# Altium schematic sheet microcontroller.SchDoc
size A2
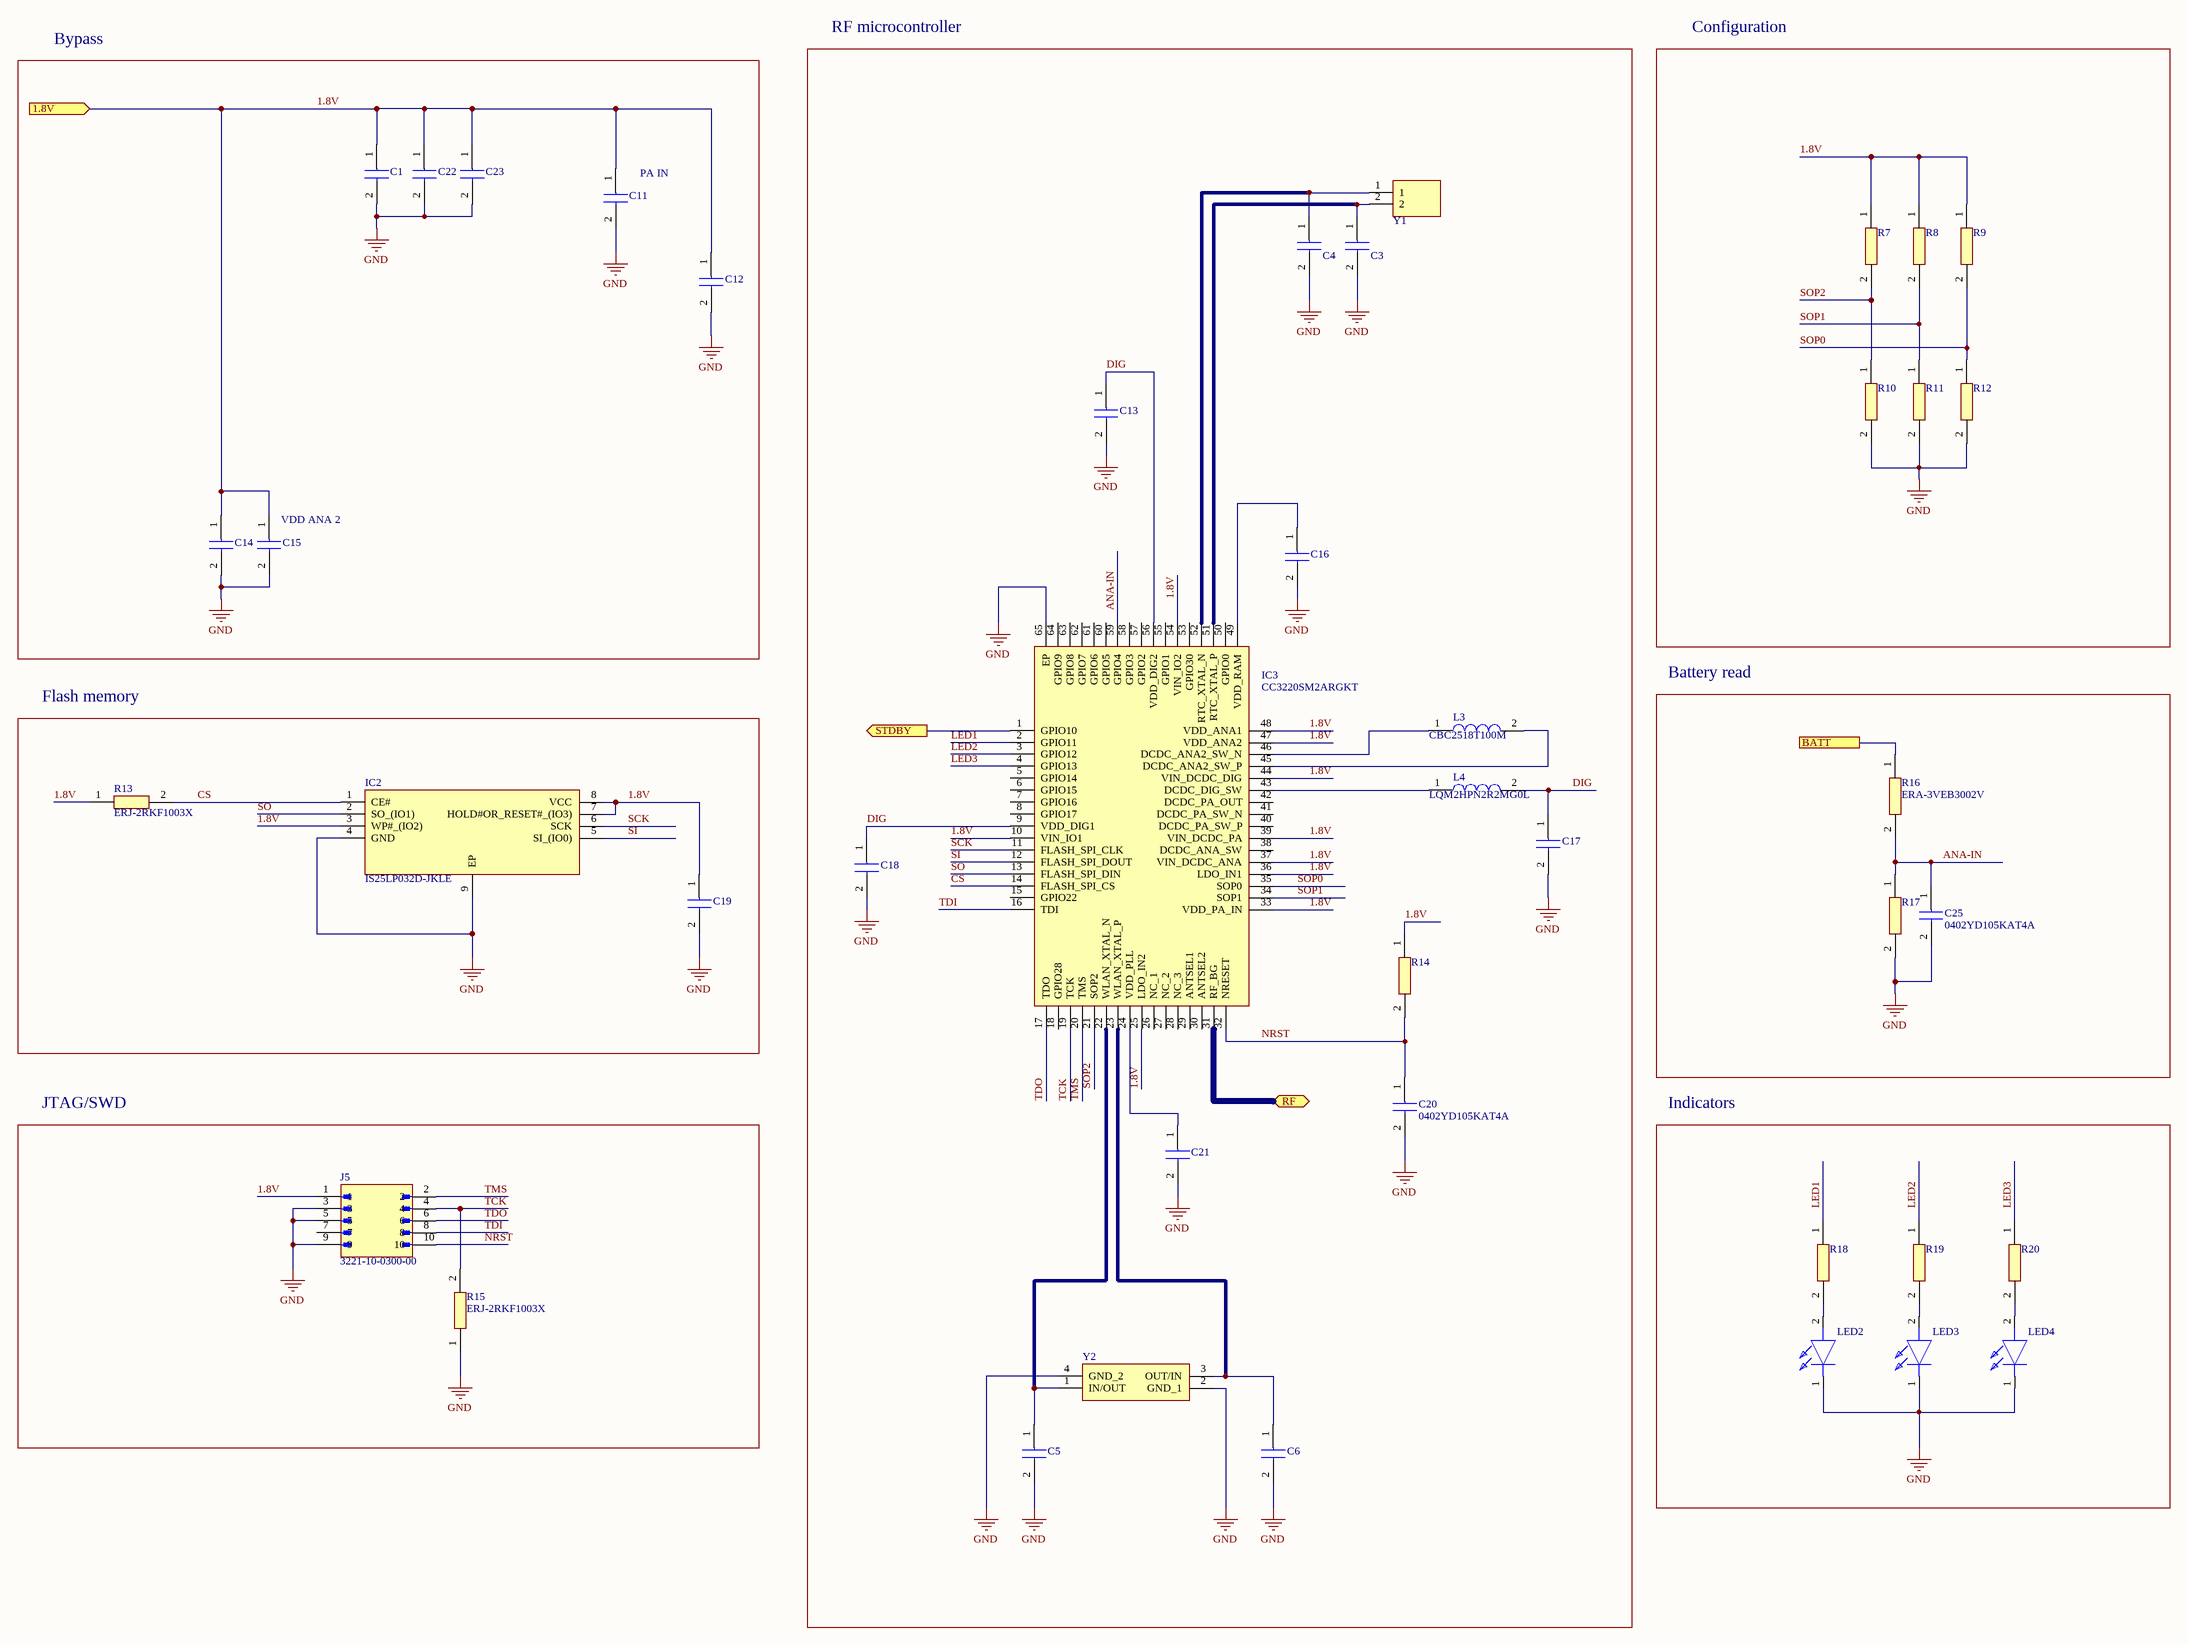
[diagram p0: microcontroller.SchDoc]

## Parts
C1  C1005X5R0J475M050BC  [C1005_Commercial]  (value not drawn)
C3  GRM1555C1H100JA01D  [CAPC1005X55N]  (value not drawn)
C4  GRM1555C1H100JA01D  [CAPC1005X55N]  (value not drawn)
C5  GRM1555C1H6R2CA01D  [CAPC1005X55N]  (value not drawn)
C6  GRM1555C1H6R2CA01D  [CAPC1005X55N]  (value not drawn)
C11  GRM158R60J226ME01D  [CAPC1005X80N]  (value not drawn)
C12  0402YD105KAT4A  [CAPC1005X56N]  (value not drawn)
C13  C1005X7R1C104K050BC  [C1005_Commercial]  (value not drawn)
C14  GRM155C80G106ME44D  [CAPC1005X55N]  (value not drawn)
C15  GRM155C80G106ME44D  [CAPC1005X55N]  (value not drawn)
C16  C1005X7R1C104K050BC  [C1005_Commercial]  (value not drawn)
C17  GRM155C80G106ME44D  [CAPC1005X55N]  (value not drawn)
C18  C1005X7R1C104K050BC  [C1005_Commercial]  (value not drawn)
C19  C1005X7R1C104K050BC  [C1005_Commercial]  (value not drawn)
C20  0402YD105KAT4A  [CAPC1005X56N]
C21  C1005X7R1C104K050BC  [C1005_Commercial]  (value not drawn)
C22  C1005X5R0J475M050BC  [C1005_Commercial]  (value not drawn)
C23  C1005X5R0J475M050BC  [C1005_Commercial]  (value not drawn)
C25  0402YD105KAT4A  [CAPC1005X56N]
IC2  IS25LP032D-JKLE  [SON127P600X500X80-9N-D]
IC3  CC3220SM2ARGKT  [QFN50P900X900X100-65N-D]
J5  3221-10-0300-00  [CNC_3221-10-0300-00]
L3  CBC2518T100M  [INDC2518X180N]
L4  LQM2HPN2R2MG0L  [INDC2520X100N]
LED2  LT_QH9G-Q2OO-25-2Z4Y  [LEDC1005X40N]  (value not drawn)
LED3  LT_QH9G-Q2OO-25-2Z4Y  [LEDC1005X40N]  (value not drawn)
LED4  LT_QH9G-Q2OO-25-2Z4Y  [LEDC1005X40N]  (value not drawn)
R7  ERJ-2RKF1003X  [ERJ2R_(0402)]  (value not drawn)
R8  ERJ-2RKF1003X  [ERJ2R_(0402)]  (value not drawn)
R9  ERJ-2RKF1003X  [ERJ2R_(0402)]  (value not drawn)
R10  ERJ-2RKF1003X  [ERJ2R_(0402)]  (value not drawn)
R11  ERJ-2RKF1003X  [ERJ2R_(0402)]  (value not drawn)
R12  ERJ-2RKF1003X  [ERJ2R_(0402)]  (value not drawn)
R13  ERJ-2RKF1003X  [ERJ2R_(0402)]
R14  ERJ-2RKF1003X  [ERJ2R_(0402)]  (value not drawn)
R15  ERJ-2RKF1003X  [ERJ2R_(0402)]
R16  ERA-3VEB3002V  [ERA3KV_(0603)]
R17  RT0603BRD0750KL  [RESC1608X55N]  (value not drawn)
R18  CR0402-FX-6200GLF  [RESC1005X40N]  (value not drawn)
R19  CR0402-FX-6200GLF  [RESC1005X40N]  (value not drawn)
R20  CR0402-FX-6200GLF  [RESC1005X40N]  (value not drawn)
Y1  ABS07-32.768KHZ-9-T  [ABS-07]  (value not drawn)
Y2  ECS-400-8-36B-7KY-TR  [ECS400836B7KYTR]  (value not drawn)

## Blocks framed on the sheet
Bypass: C1 C11 C12 C14 C15 C22 C23
RF microcontroller: C3-C6 C13 C16-C18 C20 C21 IC3 L3 L4 R14 Y1 Y2
Configuration: R7-R12
Battery read: C25 R16 R17
Flash memory: C19 IC2 R13
JTAG/SWD: J5 R15
Indicators: LED2-LED4 R18-R20

## Ports
1.8V (in), BATT, RF (bidir), STDBY (out)

## Nets
GND: C1.2 C3.2 C4.2 C5.2 C6.2 C11.2 C12.2 C13.2 C14.2 C15.2 C16.2 C17.2 C18.2 C19.2 C20.2 C21.2 C22.2 C23.2 C25.2 IC2.4(GND) IC2.9(EP) IC3.65(EP) J5.3 J5.5 J5.9 LED2.1(K) LED3.1(K) LED4.1(K) R10.2 R11.2 R12.2 R15.1 R17.2 Y2.2(GND_1) Y2.4(GND_2)
1.8V: C1.1 C11.1 C12.1 C14.1 C15.1 C19.1 C22.1 C23.1 IC2.3(WP#_(IO2)) IC2.7(HOLD#OR_RESET#_(IO3)) IC2.8(VCC) IC3.10(VIN_IO1) IC3.25(LDO_IN2) IC3.33(VDD_PA_IN) IC3.36(LDO_IN1) IC3.37(VIN_DCDC_ANA) IC3.39(VIN_DCDC_PA) IC3.44(VIN_DCDC_DIG) IC3.47(VDD_ANA2) IC3.48(VDD_ANA1) IC3.54(VIN_IO2) J5.1 R7.1 R8.1 R9.1 R13.1 R14.1 ; port 1.8V
ANA-IN: C25.1 IC3.59(GPIO4) R16.2 R17.1
BATT: R16.1 ; port BATT
CS: IC2.1(CE#) IC3.14(FLASH_SPI_CS) R13.2
DIG: C13.1 C17.1 C18.1 IC3.9(VDD_DIG1) IC3.56(VDD_DIG2) L4.2
LED1: IC3.2(GPIO11) R18.1
LED2: IC3.3(GPIO12) R19.1
LED3: IC3.4(GPIO13) R20.1
NRST: C20.1 IC3.32(NRESET) J5.10 R14.2
RF: IC3.31(RF_BG) ; port RF
SCK: IC2.6(SCK) IC3.11(FLASH_SPI_CLK)
SI: IC2.5(SI_(IO0)) IC3.12(FLASH_SPI_DOUT)
SO: IC2.2(SO_(IO1)) IC3.13(FLASH_SPI_DIN)
SOP0: IC3.35(SOP0) R9.2 R12.1
SOP1: IC3.34(SOP1) R8.2 R11.1
SOP2: IC3.21(SOP2) R7.2 R10.1
STDBY: IC3.1(GPIO10) ; port STDBY
TCK: IC3.19(TCK) J5.4 R15.2
TDI: IC3.16(TDI) J5.8
TDO: IC3.17(TDO) J5.6
TMS: IC3.20(TMS) J5.2
NetC3_1: C3.1 IC3.51(RTC_XTAL_P) Y1.2
NetC4_1: C4.1 IC3.52(RTC_XTAL_N) Y1.1
NetC5_1: C5.1 IC3.22(WLAN_XTAL_N) Y2.1(IN/OUT)
NetC6_1: C6.1 IC3.23(WLAN_XTAL_P) Y2.3(OUT/IN)
NetC16_1: C16.1 IC3.49(VDD_RAM)
NetC21_1: C21.1 IC3.24(VDD_PLL)
NetIC3_43: IC3.43(DCDC_DIG_SW) L4.1
NetIC3_45: IC3.45(DCDC_ANA2_SW_P) L3.2
NetIC3_46: IC3.46(DCDC_ANA2_SW_N) L3.1
NetLED2_2: LED2.2(A) R18.2
NetLED3_2: LED3.2(A) R19.2
NetLED4_2: LED4.2(A) R20.2

Not connected (* = marked no-connect by the designer): IC3 5(GPIO14) 6(GPIO15) 7(GPIO16) 8(GPIO17) 15(GPIO22) 18(GPIO28) 26(NC_1) 27(NC_2) 28(NC_3) 29(ANTSEL1) 30(ANTSEL2) 38(DCDC_ANA_SW) 40(DCDC_PA_SW_P) 41(DCDC_PA_SW_N) 42(DCDC_PA_OUT) 50(GPIO0) 53(GPIO30) 55(GPIO1) 57(GPIO2) 58(GPIO3) 60(GPIO5) 61(GPIO6) 62(GPIO7) 63(GPIO8) 64(GPIO9); J5 7

## Notes on the sheet
- (near C11) PA IN
- (near C15) VDD ANA 2
- Title
- Size:
- Date:
- File:
- A2
- Number:
- Time:
- Revision:
- Sheet
- of

## Library data of the parts
C1 C22 C23 = C1005X5R0J475M050BC: Capacitor; Manufacturer_Name: TDK; Datasheet Link: https://product.tdk.com/system/files/dam/doc/product/capacitor/ceramic/mlcc/catalog/mlcc_commercial_general_en.pdf; Height: 0.55mm; Manufacturer_Part_Number: C1005X5R0J475M050BC; Mouser Part Number: 810-C1005X5R0J475M; Mouser Price/Stock: https://www.mouser.co.uk/ProductDetail/TDK/C1005X5R0J475M050BC?qs=NRhsANhppD%2Fq1XiyABABNQ%3D%3D; Arrow Part Number: C1005X5R0J475M050BC; Arrow Price/Stock: https://www.arrow.com/en/products/c1005x5r0j475m050bc/tdk
C3 C4 = GRM1555C1H100JA01D: Capacitor; Manufacturer_Name: Murata Electronics; Datasheet Link: https://datasheet.datasheetarchive.com/originals/distributors/Datasheets_SAMA/ec4f1577dddcc7a13ddad897a28002d3.pdf; Height: 0.55mm; Manufacturer_Part_Number: GRM1555C1H100JA01D; Mouser Part Number: 81-GRM1555C1H100JA1D; Mouser Price/Stock: https://www.mouser.co.uk/ProductDetail/Murata-Electronics/GRM1555C1H100JA01D?qs=to8XolpOzrNUIL4CZ%252BkORA%3D%3D; Arrow Part Number: GRM1555C1H100JA01D; Arrow Price/Stock: https://www.arrow.com/en/products/grm1555c1h100ja01d/murata-manufacturing
C5 C6 = GRM1555C1H6R2CA01D: Capacitor; Manufacturer_Name: Murata Electronics; Datasheet Link: https://datasheet.datasheetarchive.com/originals/distributors/Datasheets_SAMA/ec4f1577dddcc7a13ddad897a28002d3.pdf; Height: 0.55mm; Manufacturer_Part_Number: GRM1555C1H6R2CA01D; Mouser Part Number: 81-GRM1555C1H6R2CA1D; Mouser Price/Stock: https://www.mouser.co.uk/ProductDetail/Murata-Electronics/GRM1555C1H6R2CA01D?qs=e%252BE4OD6MgMdxw4b5lMPkpQ%3D%3D; Arrow Part Number: GRM1555C1H6R2CA01D; Arrow Price/Stock: https://www.arrow.com/en/products/grm1555c1h6r2ca01d/murata-manufacturing?region=nac
C11 = GRM158R60J226ME01D: Capacitor; Manufacturer_Name: Murata Electronics; Datasheet Link: https://search.murata.co.jp/Ceramy/image/img/A01X/G101/ENG/GRM158R60J226ME01-01A.pdf; Height: 0.8mm; Manufacturer_Part_Number: GRM158R60J226ME01D; Mouser Part Number: 81-GRM158R60J226ME1D; Mouser Price/Stock: https://www.mouser.co.uk/ProductDetail/Murata-Electronics/GRM158R60J226ME01D?qs=hd1VzrDQEGhRlVgN8RQ1oA%3D%3D; Arrow Part Number: GRM158R60J226ME01D; Arrow Price/Stock: https://www.arrow.com/en/products/grm158r60j226me01d/murata-manufacturing?region=europe
C12 C20 C25 = 0402YD105KAT4A: Capacitor; Manufacturer_Name: AVX; Datasheet Link: https://datasheet.datasheetarchive.com/originals/dk/DKDS40/DSANUWW008853.pdf; Height: 0.56mm; Manufacturer_Part_Number: 0402YD105KAT4A; Mouser Part Number: 581-0402YD105KAT4A; Mouser Price/Stock: https://www.mouser.co.uk/ProductDetail/AVX/0402YD105KAT4A?qs=mQP6vorrPAd40YYIeuHDNw%3D%3D
C13 C16 C18 C19 C21 = C1005X7R1C104K050BC: Capacitor; Manufacturer_Name: TDK; Datasheet Link: https://product.tdk.com/system/files/dam/doc/product/capacitor/ceramic/mlcc/catalog/mlcc_commercial_general_en.pdf; Height: 0.55mm; Manufacturer_Part_Number: C1005X7R1C104K050BC; Mouser Part Number: 810-C1005X7R1C104K; Mouser Price/Stock: https://www.mouser.co.uk/ProductDetail/TDK/C1005X7R1C104K050BC?qs=NRhsANhppD%252BhAGOapA8QKQ%3D%3D; Arrow Part Number: C1005X7R1C104K050BC; Arrow Price/Stock: https://www.arrow.com/en/products/c1005x7r1c104k050bc/tdk?region=nac
C14 C15 C17 = GRM155C80G106ME44D: Capacitor; Manufacturer_Name: Murata Electronics; Height: 0.55mm; Manufacturer_Part_Number: GRM155C80G106ME44D; Mouser Part Number: 81-GRM155C80G106ME44; Mouser Price/Stock: https://www.mouser.co.uk/ProductDetail/Murata-Electronics/GRM155C80G106ME44D?qs=T3oQrply3y9851rB85WA8A%3D%3D
IC2 = IS25LP032D-JKLE: Integrated Circuit; Manufacturer_Name: Integrated Silicon Solution Inc.; Datasheet Link: https://www.arrow.com/en/products/is25lp032d-jkle/integrated-silicon-solution-inc?region=nac; Height: 0.8mm; Manufacturer_Part_Number: IS25LP032D-JKLE; Mouser Part Number: 870-IS25LP032D-JKLE; Mouser Price/Stock: https://www.mouser.co.uk/ProductDetail/ISSI/IS25LP032D-JKLE?qs=DXv0QSHKF4y5hGfg2Mzxpw%3D%3D; Arrow Part Number: IS25LP032D-JKLE; Arrow Price/Stock: https://www.arrow.com/en/products/is25lp032d-jkle/integrated-silicon-solution-inc?region=nac
IC3 = CC3220SM2ARGKT: Integrated Circuit; Manufacturer_Name: Texas Instruments; Datasheet Link: https://www.ti.com/lit/gpn/CC3220S; Height: 1mm; Manufacturer_Part_Number: CC3220SM2ARGKT; Mouser Part Number: 595-CC3220SM2ARGKT; Mouser Price/Stock: https://www.mouser.co.uk/ProductDetail/Texas-Instruments/CC3220SM2ARGKT/?qs=Mv7BduZupUjdsZg3%2FQIrGA%3D%3D; Arrow Part Number: CC3220SM2ARGKT; Arrow Price/Stock: https://www.arrow.com/en/products/cc3220sm2argkt/texas-instruments
J5 = 3221-10-0300-00: Connector Header Surface Mount 10 position 0.050 (1.27mm); MF: CNC Tech; Package: None; Check_prices: https://www.snapeda.com/parts/3221-10-0300-00/CNC+Tech/view-part/?ref=eda; Value: *; MP: 3221-10-0300-00; Availability: In Stock; Purchase-URL: https://pricing.snapeda.com/search/part/3221-10-0300-00/?ref=eda; SnapEDA_Link: https://www.snapeda.com/parts/3221-10-0300-00/CNC+Tech/view-part/?ref=snap; Price: None
L3 = CBC2518T100M: Inductor; Manufacturer_Name: TAIYO YUDEN; Datasheet Link: https://componentsearchengine.com/Datasheets/2/CBC2518T100M.pdf; Height: 1.8mm; Manufacturer_Part_Number: CBC2518T100M; Mouser Part Number: 963-CBC2518T100M; Mouser Price/Stock: https://www.mouser.co.uk/ProductDetail/Taiyo-Yuden/CBC2518T100M?qs=I6KAKw0tg2xfOZzcznL4uQ%3D%3D; Arrow Part Number: CBC2518T100M; Arrow Price/Stock: https://www.arrow.com/en/products/cbc2518t100m/taiyo-yuden
L4 = LQM2HPN2R2MG0L: Inductor; Manufacturer_Name: Murata Electronics; Datasheet Link: https://search.murata.co.jp/Ceramy/image/img/P02/JELF243B-0019.pdf; Height: 1mm; Manufacturer_Part_Number: LQM2HPN2R2MG0L; Mouser Part Number: 81-LQM2HPN2R2MG0L; Mouser Price/Stock: https://www.mouser.co.uk/ProductDetail/Murata-Electronics/LQM2HPN2R2MG0L?qs=%2F%252BYoplLUB5jZYKbM2SoJpQ%3D%3D; Arrow Part Number: LQM2HPN2R2MG0L; Arrow Price/Stock: https://www.arrow.com/en/products/lqm2hpn2r2mg0l/murata-manufacturing
LED2-LED4 = LT_QH9G-Q2OO-25-2Z4Y: LED; Manufacturer_Name: OSRAM; Manufacturer_Part_Number: LT QH9G-Q2OO-25-2Z4Y; Datasheet Link: https://dammedia.osram.info/media/resource/hires/osram-dam-5171475/LT%20QH9G_EN.pdf; Height: 0.4mm; Mouser Part Number: 720-LTQH9GQ2S225; Mouser Price/Stock: https://www.mouser.co.uk/ProductDetail/OSRAM-Opto-Semiconductors/LT-QH9G-Q2OO-25-2Z4Y?qs=74fRo9GAWsyBNNbbi2bfww%3D%3D; Arrow Part Number: LT QH9G-Q2OO-25-2Z4Y; Arrow Price/Stock: https://www.arrow.com/en/products/ltqh9g-q2oo-25-2z4y/osram-opto-semiconductors
R7-R15 = ERJ-2RKF1003X: Resistor; Manufacturer_Name: Panasonic; Datasheet Link: http://industrial.panasonic.com/cdbs/www-data/pdf/RDA0000/AOA0000C304.pdf; Height: 0.4mm; Manufacturer_Part_Number: ERJ-2RKF1003X; Mouser Part Number: 667-ERJ-2RKF1003X; Mouser Price/Stock: https://www.mouser.co.uk/ProductDetail/Panasonic/ERJ-2RKF1003X?qs=H7k1u0Mp9JQnXoBKdf15Qg%3D%3D; Arrow Part Number: ERJ-2RKF1003X; Arrow Price/Stock: https://www.arrow.com/en/products/erj-2rkf1003x/panasonic?region=nac
R16 = ERA-3VEB3002V: Resistor; Manufacturer_Name: Panasonic; Datasheet Link: http://industrial.panasonic.com/cdbs/www-data/pdf/RDM0000/RDM0000C331.pdf; Height: 0.4mm; Manufacturer_Part_Number: ERA-3VEB3002V; Mouser Part Number: 667-ERA-3VEB3002V; Mouser Price/Stock: https://www.mouser.co.uk/ProductDetail/Panasonic/ERA-3VEB3002V?qs=OlC7AqGiEDlbfxcRQEdT8g%3D%3D
R17 = RT0603BRD0750KL: Resistor; Manufacturer_Name: KEMET; Datasheet Link: https://mouser.componentsearchengine.com/Datasheets/1/RT0603BRD0750KL.pdf; Height: 0.55mm; Manufacturer_Part_Number: RT0603BRD0750KL; Mouser Part Number: 603-RT0603BRD0750KL; Mouser Price/Stock: https://www.mouser.co.uk/ProductDetail/YAGEO/RT0603BRD0750KL?qs=qpJ%252B%252B%252Bdg6p2%2FJCmrad8NSA%3D%3D; Arrow Part Number: RT0603BRD0750KL; Arrow Price/Stock: https://www.arrow.com/en/products/rt0603brd0750kl/yageo
R18-R20 = CR0402-FX-6200GLF: Resistor; Manufacturer_Name: Bourns; Datasheet Link: https://www.bourns.com/pdfs/CR0402.pdf; Height: 0.4mm; Manufacturer_Part_Number: CR0402-FX-6200GLF; Mouser Part Number: 652-CR0402FX-6200GLF; Mouser Price/Stock: https://www.mouser.co.uk/ProductDetail/Bourns/CR0402-FX-6200GLF?qs=ePR1ZvdkOKK%252BzBZSL76wNw%3D%3D; Arrow Part Number: CR0402-FX-6200GLF; Arrow Price/Stock: https://www.arrow.com/en/products/cr0402-fx-6200glf/bourns?region=nac
Y1 = ABS07-32.768KHZ-9-T: Integrated Circuit; Manufacturer_Name: ABRACON; Datasheet Link: http://www.abracon.com/Resonators/ABS07.pdf; Manufacturer_Part_Number: ABS07-32.768KHZ-9-T; Mouser Part Number: 815-ABS07-32.768K9T; Mouser Price/Stock: https://www.mouser.co.uk/ProductDetail/ABRACON/ABS07-32.768KHZ-9-T?qs=2nyfZ6BV3ogTQgR0mYqaug%3D%3D; Arrow Part Number: ABS07-32.768KHZ-9-T; Arrow Price/Stock: https://www.arrow.com/en/products/abs07-32.768khz-9-t/abracon?region=europe
Y2 = ECS-400-8-36B-7KY-TR: Crystal or Oscillator; Manufacturer_Name: ECS; Datasheet Link: https://ecsxtal.com/store/pdf/ECX-2236B.pdf; Height: 0.6mm; Manufacturer_Part_Number: ECS-400-8-36B-7KY-TR